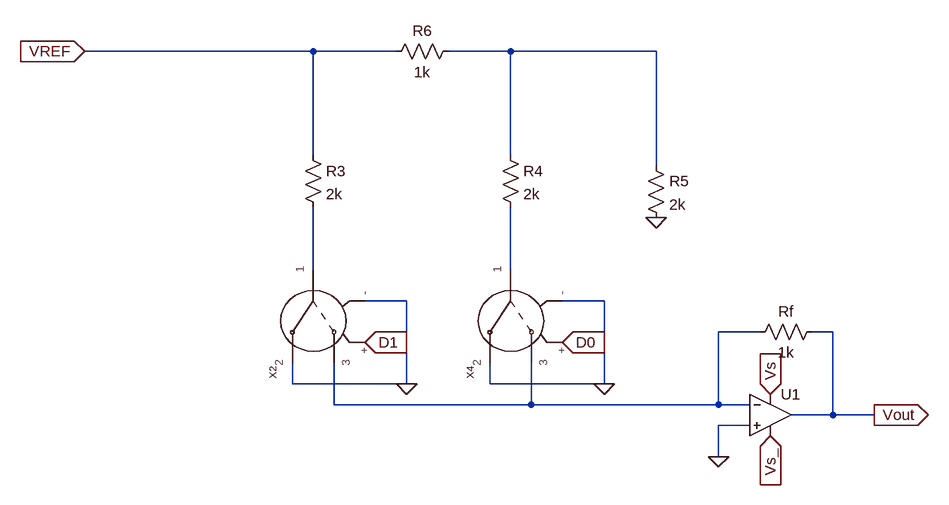
[diagram p0: schematic OUR_DAC.asc]
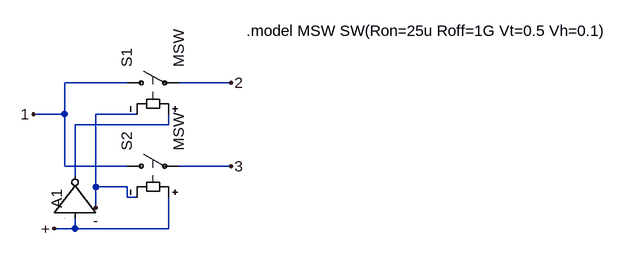
[diagram p1: sub-circuit spdt.asc]
OUR_DAC.asc, the LTspice schematic file:
Version 4
SHEET 1 1808 680
WIRE 832 -320 480 -320
WIRE 960 -320 832 -320
WIRE 1136 -320 1040 -320
WIRE 1360 -320 1136 -320
WIRE 832 -160 832 -320
WIRE 1136 -160 1136 -320
WIRE 1360 -144 1360 -320
WIRE 832 16 832 -80
WIRE 1136 16 1136 -80
WIRE 976 64 912 64
WIRE 1280 64 1216 64
WIRE 1520 112 1456 112
WIRE 1632 112 1600 112
WIRE 800 192 800 160
WIRE 976 192 976 64
WIRE 976 192 800 192
WIRE 1104 192 1104 160
WIRE 1280 192 1280 64
WIRE 1280 192 1104 192
WIRE 864 224 864 160
WIRE 1168 224 1168 160
WIRE 1168 224 864 224
WIRE 1456 224 1456 112
WIRE 1456 224 1168 224
WIRE 1504 224 1456 224
WIRE 1632 240 1632 112
WIRE 1632 240 1568 240
WIRE 1696 240 1632 240
WIRE 1504 256 1456 256
WIRE 1456 304 1456 256
FLAG 1360 -64 0
FLAG 480 -320 VREF
IOPIN 480 -320 In
FLAG 1536 208 Vs
IOPIN 1536 208 In
FLAG 1536 272 Vs_
IOPIN 1536 272 In
FLAG 1696 240 Vout
IOPIN 1696 240 Out
FLAG 1456 304 0
FLAG 1216 128 D0
IOPIN 1216 128 In
FLAG 1280 192 0
FLAG 912 128 D1
IOPIN 912 128 In
FLAG 976 192 0
SYMBOL SPDT 1136 64 M90
SYMATTR InstName X4
SYMBOL res 816 -176 R0
SYMATTR InstName R3
SYMATTR Value 2k
SYMBOL res 1120 -176 R0
SYMATTR InstName R4
SYMATTR Value 2k
SYMBOL res 1344 -160 R0
SYMATTR InstName R5
SYMATTR Value 2k
SYMBOL res 1056 -336 R90
WINDOW 0 0 56 VBottom 2
WINDOW 3 32 56 VTop 2
SYMATTR InstName R6
SYMATTR Value 1k
SYMBOL res 1616 96 R90
WINDOW 0 0 56 VBottom 2
WINDOW 3 32 56 VTop 2
SYMATTR InstName Rf
SYMATTR Value 1k
SYMBOL OpAmps\\UniversalOpAmp 1536 240 R0
SYMATTR InstName U1
SYMBOL SPDT 832 64 M90
SYMATTR InstName X2

spdt.asc, the sub-circuit schematic file:
Version 4
SHEET 1 932 680
WIRE 144 96 48 96
WIRE 304 96 224 96
WIRE 48 144 48 96
WIRE 48 144 0 144
WIRE 160 144 96 144
WIRE 208 160 208 144
WIRE 208 160 64 160
WIRE 48 224 48 144
WIRE 144 224 48 224
WIRE 304 224 224 224
WIRE 64 240 64 160
WIRE 96 256 96 144
WIRE 144 256 96 256
WIRE 144 272 144 256
WIRE 160 272 144 272
WIRE 96 288 96 256
WIRE 64 320 64 304
WIRE 64 320 32 320
WIRE 208 320 208 272
WIRE 208 320 64 320
FLAG 0 144 1
FLAG 304 96 2
FLAG 304 224 3
FLAG 32 320 +
FLAG 96 288 -
SYMBOL sw 128 96 R270
SYMATTR InstName S1
SYMATTR Value MSW
SYMBOL sw 128 224 R270
SYMATTR InstName S2
SYMATTR Value MSW
SYMBOL Digital\\inv 128 304 M270
WINDOW 3 8 60 Invisible 2
WINDOW 0 15 92 Left 2
SYMATTR Value td=10n Vhigh=5
SYMATTR InstName A1
TEXT 328 16 Left 2 !.model MSW SW(Ron=25u Roff=1G Vt=0.5 Vh=0.1)

The netlist it stands for:
* OUR_DAC.asc
XX4 N003 0 N004 D0 0 spdt
R3 VREF N002 2k
R4 N001 N003 2k
R5 N001 0 2k
R6 N001 VREF 1k
Rf Vout N004 1k
XU1 0 N004 Vs Vs_ Vout level1 Avol=1Meg GBW=10Meg Vos=0 En=0 Enk=0 In=0 Ink=0 Rin=500Meg  ; pins In+ In- V+ V- OUT
XX2 N002 0 N004 D1 0 spdt

* block symbol definitions
.subckt spdt 1 2 3 + -
S1 1 2 N001 - MSW
S2 1 3 + - MSW
A1 + 0 0 0 0 N001 0 0 BUF td=10n Vhigh=5
.model MSW SW(Ron=25u Roff=1G Vt=0.5 Vh=0.1)
.ends spdt

.lib UniversalOpAmp1.lib
.backanno
.end